# EAGLE schematic Irrigation Controller (EAGLE 9.6.2)
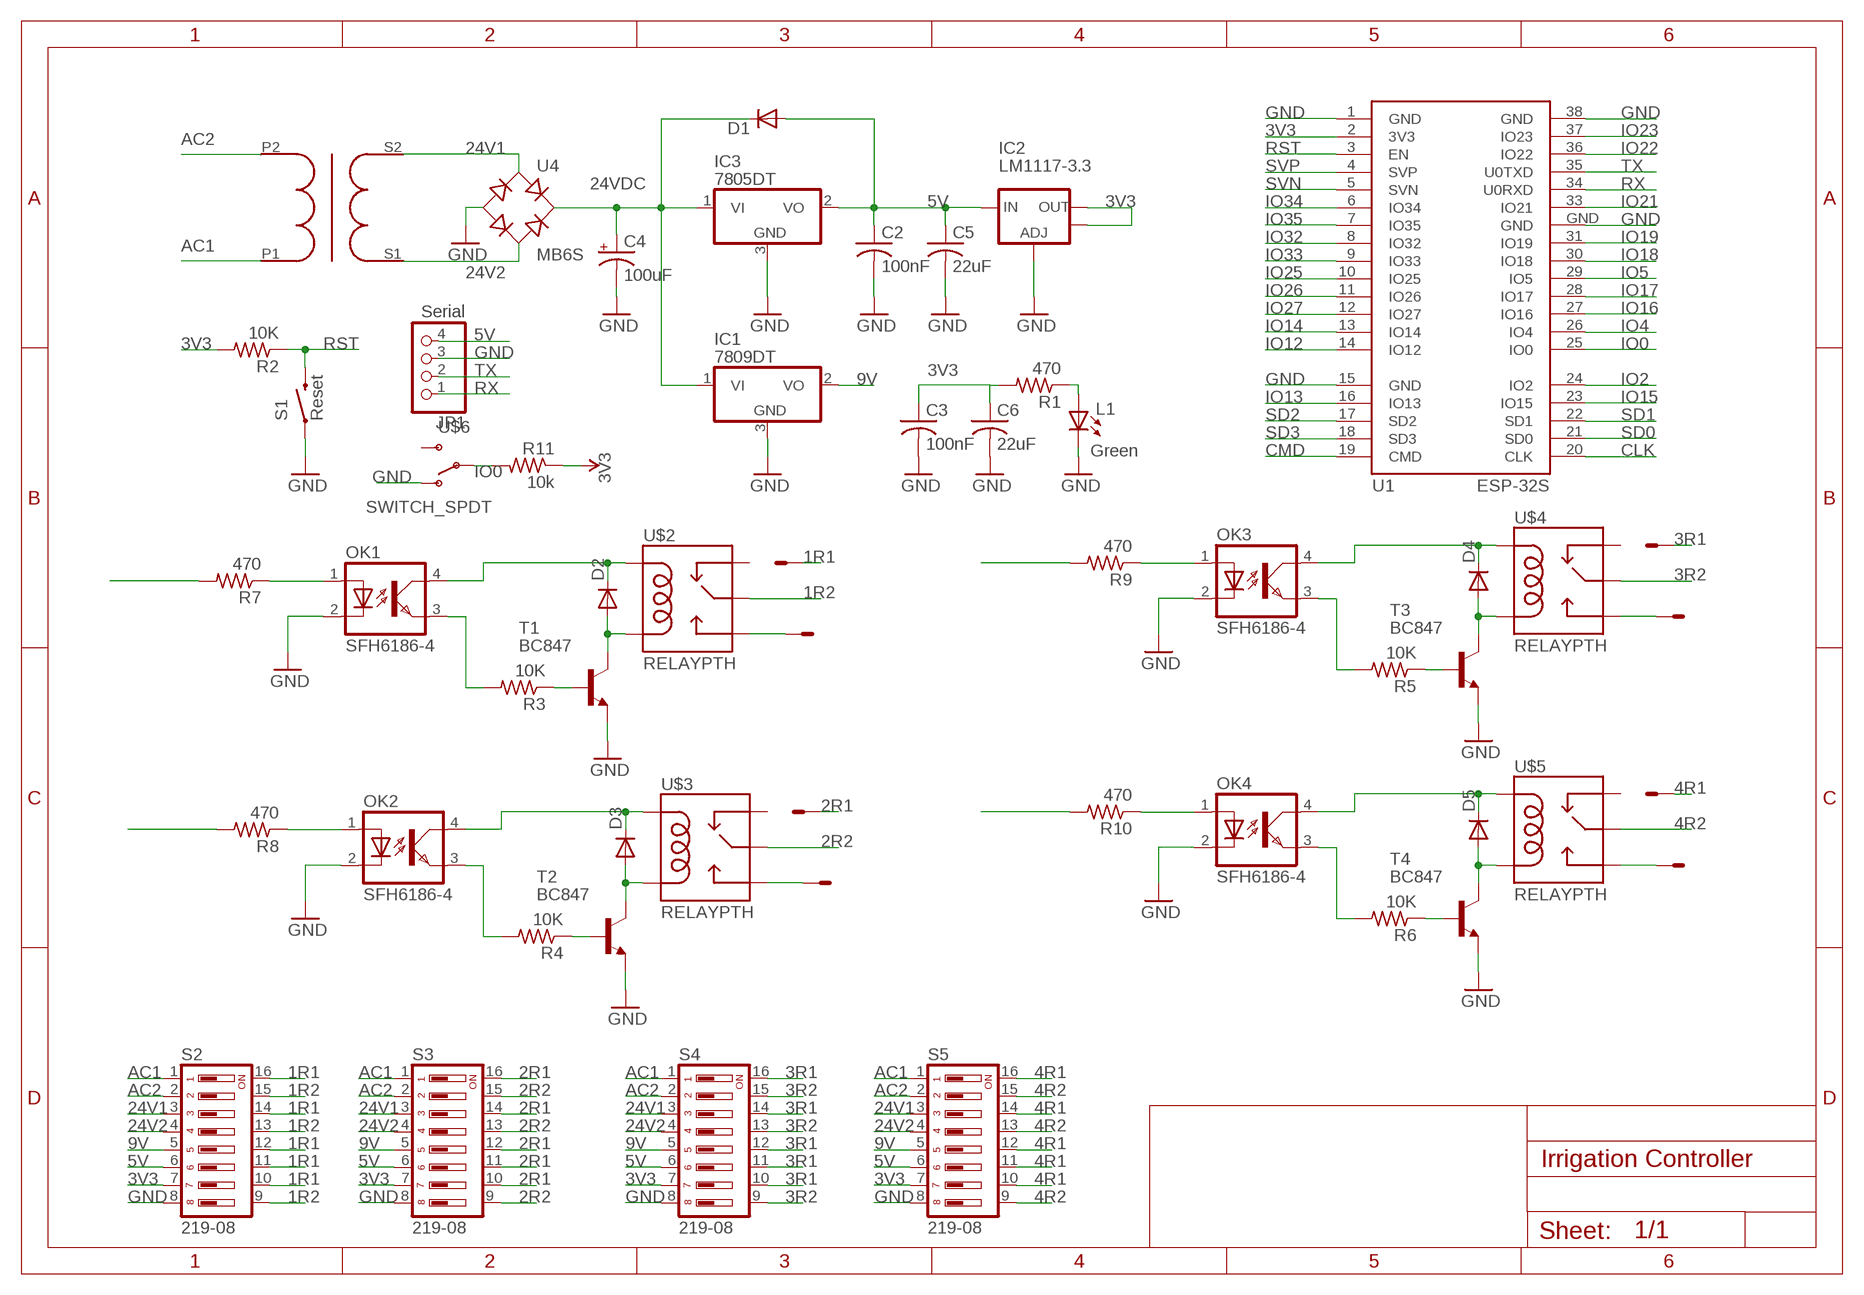
[diagram p0: schematic, sheet 1]

## Parts
C2  100nF  C1206  [1206]
C3  100nF  C1206  [1206]
C4  100uF  CPOL-USCT7343  [CT7343]
C5  22uF  C1206  [1206]
C6  22uF  C1206  [1206]
D1  DIODE-SOD123  [SOD123]
D2  DIODE-SOD123  [SOD123]
D3  DIODE-SOD123  [SOD123]
D4  DIODE-SOD123  [SOD123]
D5  DIODE-SOD123  [SOD123]
IC1  7809DT  7805DT  [TO252]
IC2  LM1117-3.3  V_REG_LM1117SOT223  [SOT223]
IC3  7805DT  [TO252]
JP1  Serial  PINHD-1X4  [1X04]
L1  Green  LED1206  [LED1206]
OK1  SFH6186-4  [SMD4-7]
OK2  SFH6186-4  [SMD4-7]
OK3  SFH6186-4  [SMD4-7]
OK4  SFH6186-4  [SMD4-7]
R1  470  R1206  [1206]
R2  10K  R-US_R1206  [R1206]
R3  10K  R-US_R1206  [R1206]
R4  10K  R-US_R1206  [R1206]
R5  10K  R-US_R1206  [R1206]
R6  10K  R-US_R1206  [R1206]
R7  470  R-US_R1206  [R1206]
R8  470  R-US_R1206  [R1206]
R9  470  R-US_R1206  [R1206]
R10  470  R-US_R1206  [R1206]
R11  10k  R1206  [1206]
S1  Reset  SWITCH-MOMENTARY-2SMD-4  [TACTILE_SWITCH_TALL]
S2  219-08  [CTS-219-08]
S3  219-08  [CTS-219-08]
S4  219-08  [CTS-219-08]
S5  219-08  [CTS-219-08]
T1  BC847  [SOT23]
T2  BC847  [SOT23]
T3  BC847  [SOT23]
T4  BC847  [SOT23]
U1  ESP-32S  [ESP-32S]
U4  MB6S  [SOIC-4]
U$1  TRANSFORMADOR_PE3010-M  [TRANSFORMADOR_PE3010-M]
U$2  RELAYPTH  [SRD-05VDC-SL-C]
U$3  RELAYPTH  [SRD-05VDC-SL-C]
U$4  RELAYPTH  [SRD-05VDC-SL-C]
U$5  RELAYPTH  [SRD-05VDC-SL-C]
U$6  SWITCH_SPDT  [KPS-1290]
X1  22-23-2021  [22-23-2021]
X2  22-23-2021  [22-23-2021]
X3  22-23-2021  [22-23-2021]
X4  22-23-2021  [22-23-2021]

## Nets
1R1: S2.10 S2.11 S2.12 S2.14 S2.16 X1.1
1R2: S2.9 S2.13 S2.15 U$2.SWCOMMON
2R1: S3.10 S3.11 S3.12 S3.14 S3.16 X2.1
2R2: S3.9 S3.13 S3.15 U$3.SWCOMMON
3R1: S4.10 S4.11 S4.12 S4.14 S4.16 X3.1
3R2: S4.9 S4.13 S4.15 U$4.SWCOMMON
3V3: C3.1 C6.1 IC2.2(OUT) IC2.4(OUT) R1.2 R2.2 R11.1 S2.7 S3.7 S4.7 S5.7 U1.2(3V3) ; supply symbol labelled VCC
4R1: S5.10 S5.11 S5.12 S5.14 S5.16 X4.1
4R2: S5.9 S5.13 S5.15 U$5.SWCOMMON
5V: C2.1 C5.1 D1.A IC2.3(IN) IC3.2(VO) JP1.4 S2.6 S3.6 S4.6 S5.6
9V: IC1.2(VO) S2.5 S3.5 S4.5 S5.5
24V1: S2.3 S3.3 S4.3 S5.3 U4.~1(AC1) U$1.S2
24V2: S2.4 S3.4 S4.4 S5.4 U4.~2(AC2) U$1.S1
24VDC: C4.+ D1.C IC1.1(VI) IC3.1(VI) U4.+
AC1: S2.1 S3.1 S4.1 S5.1 U$1.P1
AC2: S2.2 S3.2 S4.2 S5.2 U$1.P2
CLK: U1.20(CLK)
CMD: U1.19(CMD)
GND: C2.2 C3.2 C4.- C5.2 C6.2 IC1.3(GND) IC2.1(ADJ) IC3.3(GND) JP1.3 L1.C OK1.2(C) OK2.2(C) OK3.2(C) OK4.2(C) S1.A2 S2.8 S3.8 S4.8 S5.8 T1.2(E) T2.2(E) T3.2(E) T4.2(E) U1.1(GND) U1.15(GND) U1.38(GND) U1.GND U4.- U$6.O
IO0: R11.2 U1.25(IO0) U$6.P
IO2: U1.24(IO2)
IO4: U1.26(IO4)
IO5: U1.29(IO5)
IO12: U1.14(IO12)
IO13: U1.16(IO13)
IO14: U1.13(IO14)
IO15: U1.23(IO15)
IO16: U1.27(IO16)
IO17: U1.28(IO17)
IO18: U1.30(IO18)
IO19: U1.31(IO19)
IO21: U1.33(IO21)
IO22: U1.36(IO22)
IO23: U1.37(IO23)
IO25: U1.10(IO25)
IO26: U1.11(IO26)
IO27: U1.12(IO27)
IO32: U1.8(IO32)
IO33: U1.9(IO33)
IO34: U1.6(IO34)
IO35: U1.7(IO35)
N$1: U$5.SWOPEN X4.2
N$2: U$4.SWOPEN X3.2
N$3: L1.A R1.1
N$4: U$3.SWOPEN X2.2
N$5: U$2.SWOPEN X1.2
N$6: D2.C OK1.4(COL) U$2.COIL1
N$7: D2.A T1.3(C) U$2.COIL0
N$8: OK1.3(EMIT) R3.2
N$9: R3.1 T1.1(B)
N$10: D3.C OK2.4(COL) U$3.COIL1
N$11: D3.A T2.3(C) U$3.COIL0
N$12: OK2.3(EMIT) R4.2
N$13: R4.1 T2.1(B)
N$14: D4.C OK3.4(COL) U$4.COIL1
N$15: D4.A T3.3(C) U$4.COIL0
N$16: OK3.3(EMIT) R5.2
N$17: R5.1 T3.1(B)
N$18: D5.C OK4.4(COL) U$5.COIL1
N$19: D5.A T4.3(C) U$5.COIL0
N$20: OK4.3(EMIT) R6.2
N$21: R6.1 T4.1(B)
N$22: OK1.1(A) R7.1
N$23: R7.2
N$25: OK2.1(A) R8.1
N$26: R8.2
N$27: OK3.1(A) R9.1
N$28: R9.2
N$29: OK4.1(A) R10.1
N$30: R10.2
RST: R2.1 S1.B2 U1.3(EN)
RX: JP1.1 U1.34(U0RXD)
SD0: U1.21(SD0)
SD1: U1.22(SD1)
SD2: U1.17(SD2)
SD3: U1.18(SD3)
SVN: U1.5(SVN)
SVP: U1.4(SVP)
TX: JP1.2 U1.35(U0TXD)
Unconnected: U$2.SWCLOSED(SWCLOSE) U$3.SWCLOSED(SWCLOSE) U$4.SWCLOSED(SWCLOSE) U$5.SWCLOSED(SWCLOSE) U$6.S

## Library data of the parts
C2 C3 C5 C6 = SpaceDIY_passive_components:C1206
C4 = resistor:CPOL-US: POLARIZED CAPACITOR, American symbol
D1-D5 = diode:DIODE-: DIODE
IC1 IC3 = linear:78*: Positive VOLTAGE REGULATOR Source: http://cache.national.com/ds/LM/LM78L05.pdf http://www.fairchildsemi.com/ds/LM/LM7805.pdf
IC2 = SparkFun:V_REG_LM1117: Voltage Regulator LM1117 Standard adjustable voltage regulator but in SMD form. Spark Fun Electronics SKU : COM-00595
JP1 = SpaceDIY_connectors:PINHD-1X4: PIN HEADER
L1 = SpaceDIY_passive_components:LED1206
OK1-OK4 = optocoupler:SFH618?*: Optocoupler, Phototransistor Output, Low Input Current Source: Data sheet <http://www.vishay.com/docs/83673/sfh618.pdf>; MF: VISHAY/TELEFUNKEN; MPN: SFH6186-4; OC_FARNELL: 1469530; OC_NEWARK: 21H7753
R1 R11 = SpaceDIY_passive_components:R1206
R2-R10 = resistor:R-US_: RESISTOR, American symbol
S1 = Testing:SWITCH-MOMENTARY-2: Various NO switches- pushbuttons, reed, etc
S2-S5 = switch-dil:219-08*: Surface Mount DIP Switch Series 219 SMT CTS Electronic Components Sourc: www.ctscorp.com; OC_FARNELL: unknown; OC_NEWARK: unknown
T1-T4 = transistor:BC847: NPN TRANSISTOR
U1 = esp32:ESP-32S: Ai-Thinker ESP-32S
U4 = rectifier:MB*S: Bridge Rectifier Source: http://www.fairchildsemi.com/ds/MB/MB6S.pdf
U$1 = SpaceDIY_special_components:TRANSFORMADOR_PE3010-M
U$2-U$5 = SpaceDIY_actuators:RELAY: SPDT relay (COM-00101)
U$6 = SparkFun-Retired:SWITCH_SPDT: SWCH-10651 Side-actuated SPDT slide switch, as used on the Arduino Pro; PROD_ID: SWCH-10651
X1-X4 = con-molex:22-23-2021: .100" (2.54mm) Center Header - 2 Pin; MF: MOLEX; MPN: 22-23-2021; OC_FARNELL: 1462926; OC_NEWARK: 25C3832